# EAGLE design smd_version (EAGLE 5.02)
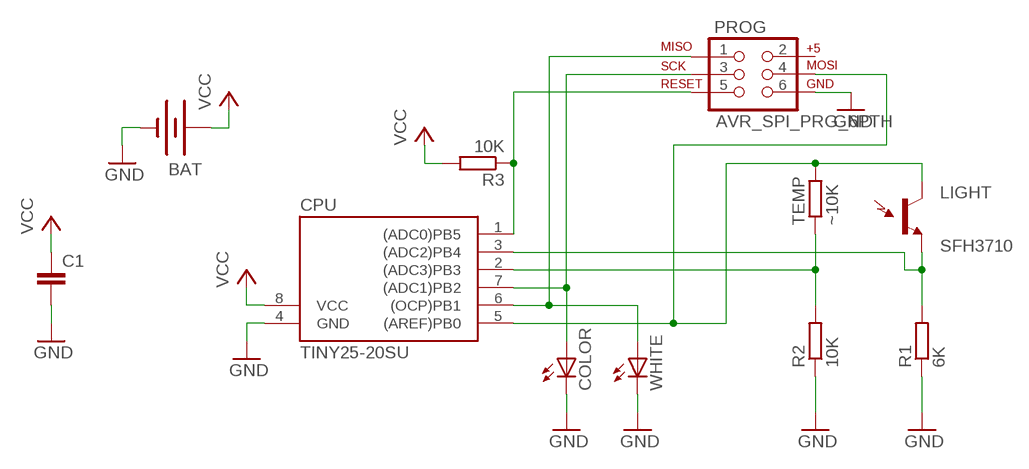
[diagram p0: schematic, sheet 1]

## Parts
BAT  BATTERY20PTH  [BATTCOM_20MM_PTH]
C1  C-EUC0805K  [C0805K]
COLOR  LEDP-LCC-2  [P-LCC-2]
CPU  TINY25-20SU  [SOIC8]
LIGHT  SFH3710  [SFH3710]
PROG  AVR_SPI_PRG_6PTH  [2X3]
R1  6K  R-EU_R0805W  [R0805W]
R2  10K  R-EU_R0805W  [R0805W]
R3  10K  R-EU_R0805W  [R0805W]
TEMP  ~10K  R-EU_0204/5  [0204/5]
WHITE  LEDP-LCC-2  [P-LCC-2]

## Nets
GND: BAT.2(-) C1.2 COLOR.C CPU.4(GND) PROG.6 R1.1 R2.1 WHITE.C
N$1: CPU.6((OCP)PB1) PROG.1 WHITE.A
N$2: CPU.1((ADC0)PB5) PROG.5 R3.1
N$3: CPU.5((AREF)PB0) LIGHT.P$1(C1) PROG.4 TEMP.2
N$4: CPU.2((ADC3)PB3) R2.2 TEMP.1
N$5: CPU.3((ADC2)PB4) LIGHT.P$2(E1) R1.2
N$6: COLOR.A CPU.7((ADC1)PB2) PROG.3
VCC: BAT.1(+) C1.1 CPU.8(VCC) R3.2
Unconnected: PROG.2

## Library data of the parts
BAT = SparkFun:BATTERY: Battery Holders Various common sizes : AA, AAA, 20mm coin cell and 12mm coin cell.
C1 = rcl:C-EU: CAPACITOR, European symbol
COLOR WHITE = led:LED: LED OSRAM: - CHIPLED LG R971, LG N971, LY N971, LG Q971, LY Q971, LO R971, LY R971 LH N974, LH R974 LS Q976, LO Q976, LY Q976 LO Q996 - Hyper CHIPLED LW Q18S LB Q993, LB Q99A, LB R99A - SideLED LS A670, LO A670, LY A670, LG A670, LP A670 LB A673, LV A673, LT A673, LW A673 LH A674 LY A675 LS A676, LA A676, LO A676, LY A676, LW A676 LS A679, LY A679, LG A679 - Hyper Micro SIDELED® LS Y876, LA Y876, LO Y876, LY Y876 LT Y87S - SmartLED LW L88C, LW L88S LB L89C, LB L89S, LG L890 LS L89K, LO L89K, LY L89K LS L896, LA L896, LO L896, LY L896 - TOPLED LS T670, LO T670, LY T670, LG T670, LP T670 LSG T670, LSP T670, LSY T670, LOP T670, LYG T670 LG T671, LOG T671, LSG T671 LB T673, LV T673, LT T673, LW T673 LH T674 LS T676, LA T676, LO T676, LY T676, LB T676, LH T676, LSB T676, LW T676 LB T67C, LV T67C, LT T67C, LS T67K, LO T67K, LY T67K, LW E67C LS E67B, LA E67B, LO E67B, LY E67B, LB E67C, LV E67C, LT E67C LW T67C LS T679, LY T679, LG T679 LS T770, LO T770, LY T770, LG T770, LP T770 LB T773, LV T773, LT T773, LW T773 LH T774 LS E675, LA E675, LY E675, LS T675 LS T776, LA T776, LO T776, LY T776, LB T776 LHGB T686 LT T68C, LB T68C - Hyper Mini TOPLED® LB M676 - Mini TOPLED Santana® LG M470 LS M47K, LO M47K, LY M47K Source: http://www.osram.convergy.de - LUMILED® LXK2-PW12-R00, LXK2-PW12-S00, LXK2-PW14-U00, LXK2-PW14-V00 LXK2-PM12-R00, LXK2-PM12-S00, LXK2-PM14-U00 LXK2-PE12-Q00, LXK2-PE12-R00, LXK2-PE12-S00, LXK2-PE14-T00, LXK2-PE14-U00 LXK2-PB12-K00, LXK2-PB12-L00, LXK2-PB12-M00, LXK2-PB14-N00, LXK2-PB14-P00, LXK2-PB14-Q00 LXK2-PR12-L00, LXK2-PR12-M00, LXK2-PR14-Q00, LXK2-PR14-R00 LXK2-PD12-Q00, LXK2-PD12-R00, LXK2-PD12-S00 LXK2-PH12-R00, LXK2-PH12-S00 LXK2-PL12-P00, LXK2-PL12-Q00, LXK2-PL12-R00 Source: www.luxeon.com
CPU = avr-2:TINY25
LIGHT = sfh3410:SFH3710
PROG = SparkFun:AVR_SPI_PRG_6: AVR ISP 6 Pin This is the reduced ISP connector for AVR programming. Common on Arduino. This footprint will take up less PCB space and can be used with a 10-pin to 6-pin adapter such as SKU: BOB-08508
R1-R3 TEMP = rcl:R-EU_: RESISTOR, European symbol

## Board
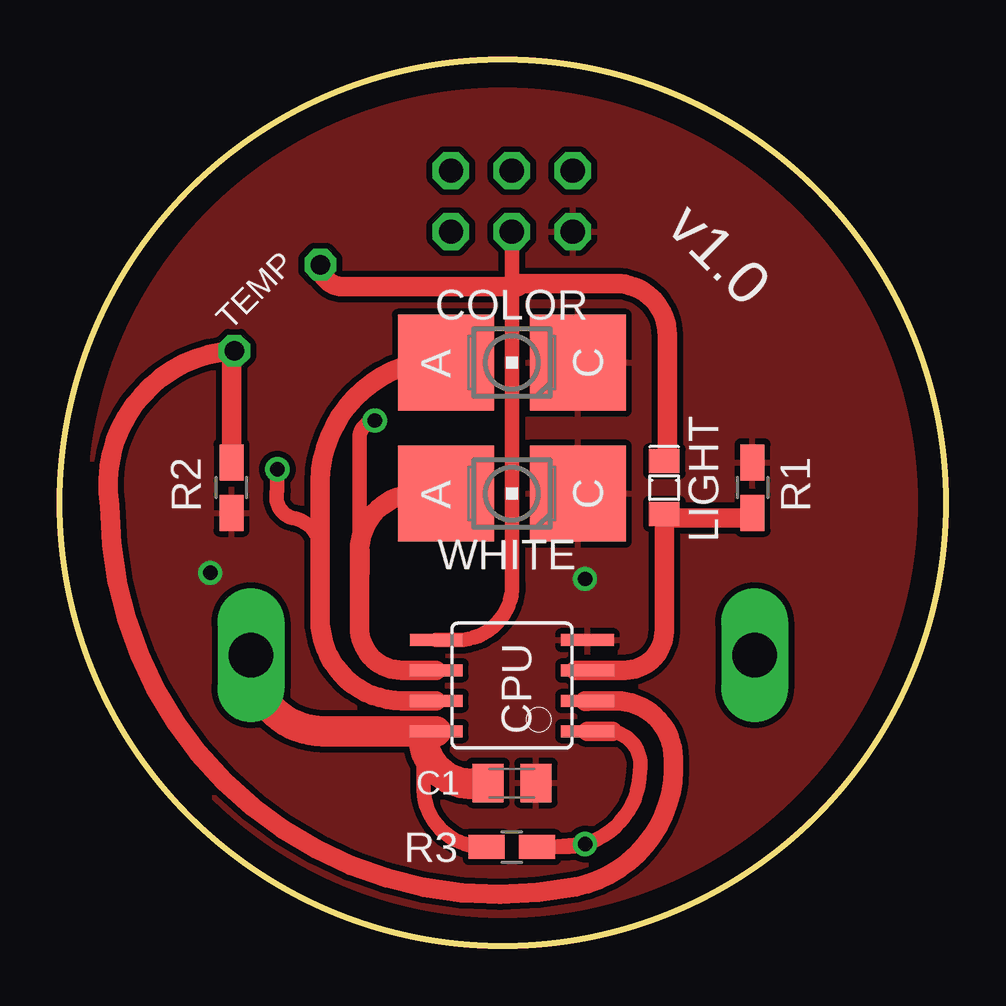
[diagram p1: board, top side]
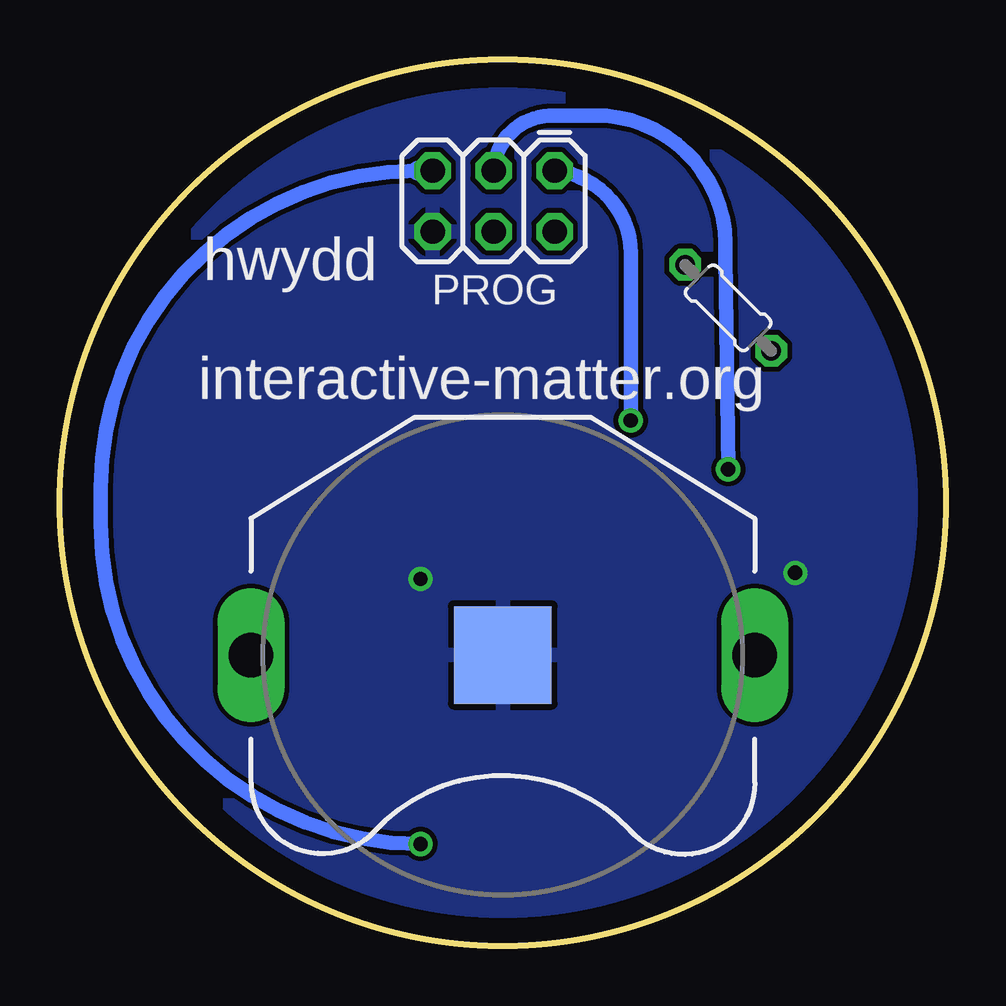
[diagram p2: board, bottom side, seen from below]

Size 36.92 x 36.92 mm. Coordinates in mm from the lower left corner, seen from the top.
Outline: circle at 18.46,18.46 radius 18.46
Copper layers (1*16): Top 0.035mm / dielectric 1.5mm / Bottom 0.035mm
Design rules "default *": minimum track width 10mil, minimum drill 20mil, track to track 8mil, track to pad 8mil, pad to pad 8mil, via to via 8mil, smd to smd 8mil, copper to edge 40mil, drill to drill 8mil, minimum pad ring 10mil, minimum via ring 8mil, stop-mask expansion 4mil, vias tented up to drill 0mil, thermal gap 10mil

### Footprints (pad centres in the part's own frame; a part is rotated, then mirrored left to right if it is on the bottom)
BATTCOM_20MM_PTH = drill 1.854 long: 1 -10.5,0; 3 10.5,0 | smd 4.064 x 4.064: 2 0,0
C0805K = smd 1.3 x 1.6: 1 -1,0; 2 1,0
P-LCC-2 = smd 4 x 4: A 0,2.75; C 0,-2.75
SOIC8 = smd 0.5 x 2.2: 1 -1.905,-3.154; 2 -0.645,-3.154; 3 0.625,-3.154; 4 1.895,-3.154; 5 1.905,3.154; 6 0.635,3.154; 7 -0.635,3.154; 8 -1.905,3.154
SFH3710 = smd 1 x 1.27: P$1 -1.1,0; P$2 1.1,0
2X3 = drill 1.016 octagon: 1 0,0; 2 0,2.54; 3 2.54,0; 4 2.54,2.54; 5 5.08,0; 6 5.08,2.54
R0805W = smd 1.5 x 1: 1 -1.052,0; 2 1.052,0
0204/5 = drill 0.813 octagon: 1 -2.54,0; 2 2.54,0

### Placement (x,y rotation side)
BAT  18.46,12.11 180 bottom
C1  18.84,6.77 0 top
COLOR  18.84,24.3 90 top
CPU  18.84,10.84 90 top
LIGHT  25.19,19.09 270 top
PROG  16.3,32.3 180 bottom
R1  28.87,19.09 270 top
R2  7.16,19.09 90 top
R3  18.84,4.11 180 top
TEMP  9.06,26.59 135 bottom
WHITE  18.84,18.84 90 top

### Tracks (layer width: path | path; a pad name or v marks a point on that pad's centre or on a via)
GND  (via drill 0.6, 0.6 pad 1.02)
  other vias: 6.27,15.54 21.89,15.28
  pour Bottom: -0.46,37.38 36.87,36.87 36.87,0.04 0.04,0.04
  pour Top (isolate 0.254): -1.23,38.27 38.14,38.02 38.27,-1.35 -1.23,-1.35
N$1  (via drill 0.6 pad 1.02)
  Top 0.61: 12.49,15.54 12.62,15.54 12.62,16.43 arc90 12.49,16.55 | v13.12,21.89 arc90 12.49,21 12.49,15.66
  Top 0.813: WHITE.A 14.9,18.84 arc90 12.49,16.43 12.49,15.66 12.49,15.54 12.49,13.25 arc90 14.27,11.47 CPU.6
  Bottom 0.61: PROG.1 arc90 13.12,28.49 v13.12,21.89
N$2  (via drill 0.6 pad 1.02)
  Top 0.61: R3.1 20.49,4.11 | v21.89,4.23 arc-16 21,4.11 20.49,4.11 | v21.89,4.23 arc74 24.17,7.28 arc90 23.03,8.93 | 20.49,4.11 v21.89,4.23
  Top 0.813: 23.03,8.93 CPU.1
  Bottom 0.61: 22.01,32.3 arc-90 35.22,19.09 35.22,17.57 arc-90 v21.89,4.23
  Bottom 0.813: 22.01,32.3 PROG.5
N$3
  Top 0.61: PROG.4 18.84,27.86 arc90 19.09,27.6 | CPU.5 16.81,12.74 arc90 18.84,15.28 18.84,27.48
  Top 0.813: LIGHT.P$1 arc90 25.32,20.45 25.32,25.44 arc90 23.16,27.6 19.09,27.6 19.09,27.48 18.84,27.48 11.76,27.48 arc-90 TEMP.2
N$4
  Top 0.813: CPU.2 arc-90 21.88,10.2 23.16,10.2 arc-90 25.57,7.79 arc-82 21.51,2.46 arc-102 2.08,18.33 arc-96 7.28,24.81 TEMP.1 arc90 7.16,24.68 R2.2
N$5
  Top 0.61: 28.62,17.82 28.4,17.82 arc90 R1.2 | LIGHT.P$2 arc-90 25.27,17.82 | CPU.3 arc-90 21.5,11.47
  Top 0.813: 25.27,17.82 28.4,17.82 | LIGHT.P$2 25.19,13.12 arc-90 23.54,11.47 21.5,11.47
N$6  (via drill 0.6)
  Top 0.61: v9.06,19.86 9.06,18.97 arc90 9.7,17.82 arc-90 10.84,16.3
  Top 0.813: CPU.7 14.27,10.2 arc-90 10.84,13.63 10.84,16.3 10.84,19.35 arc-90 16.17,24.43 arc90 16.09,24.34 COLOR.A
  Bottom 0.61: PROG.3 arc90 16.3,34.59 14.14,34.59 arc90 9.19,28.75 v9.06,19.86
VCC
  Top 0.61: R3.2 arc-90 15.16,6.48 15.16,8.91
  Top 0.813: 17.44,6.77 arc90 17.46,6.92 C1.1 | 15.18,8.4 CPU.8 arc90 15.16,8.91 | 8.04,11.85 arc-90 7.96,11.94 BAT.1
  Top 1.27: 15.18,8.4 arc90 17.44,6.77 | CPU.8 10.97,8.93 arc-90 8.04,11.85

### Text on the board
tPlace: v1.0
bPlace: hwydd
bNames: interactive-matter.org